# Altium project Main Board.PrjPcb
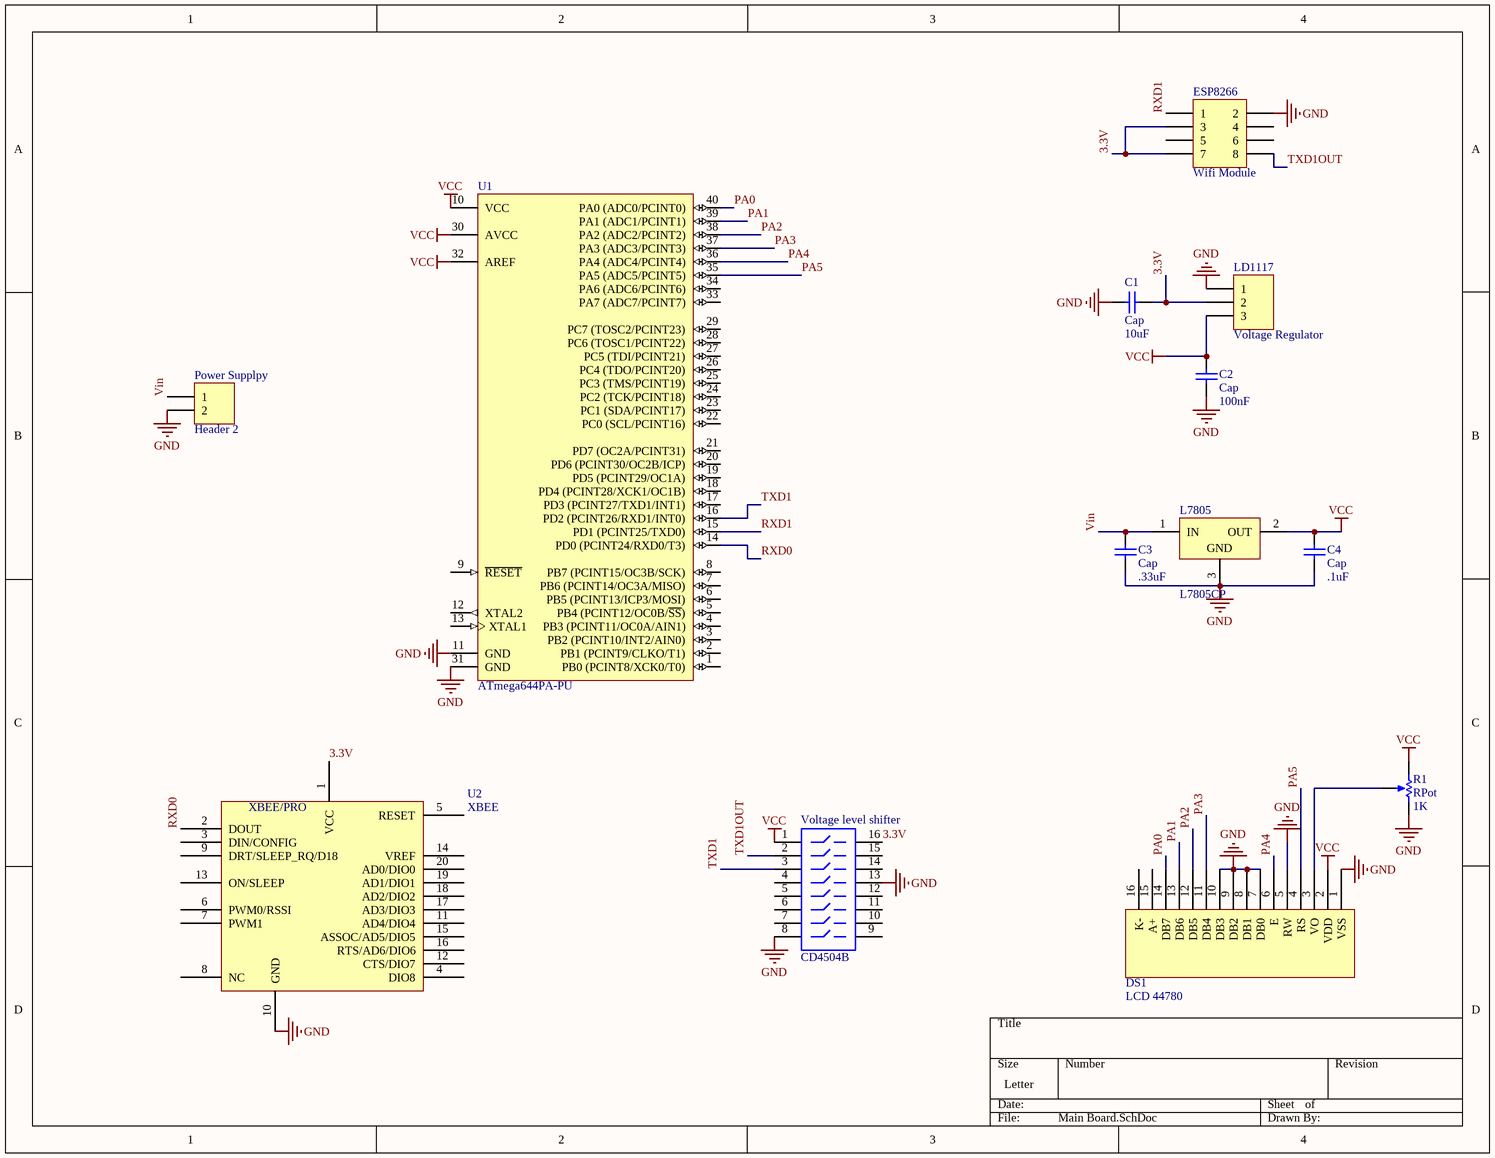
[diagram p0: Main Board.SchDoc]
1 sheet, 13 parts. Net scope: global (net labels, ports and power ports of the same name join across sheets).
Board file: Main Board.PcbDoc

## Sheet Main Board.SchDoc
size Letter

### Parts
C1  Cap  value 10uF  [RAD-0.3]
C2  Cap  value 100nF  [RAD-0.3]
C3  Cap  value .33uF  [RAD-0.3]
C4  Cap  value .1uF  [RAD-0.3]
DS1  LCD 44780  [OLED 16x2]
ESP8266  Wifi Module  [HDR2X4]
L7805  L7805CP  [ISOWATT220AB]
LD1117  Voltage Regulator  [HDR1X3]
Power_Supplpy  Header 2  [HDR1X2]
R1  RPot  value 1K  [VR5]
U1  ATmega644PA-PU  [40P6]
U2  XBEE  [XBEE/PRO]
Voltage_level_shifter  CD4504B  [DIP-16-KEY]

### Nets
GND: C1.1 C2.2 C3.1 C4.1 DS1.1(VSS) DS1.5(RW) DS1.7(DB0) DS1.8(DB1) DS1.9(DB2) DS1.10(DB3) ESP8266.2 L7805.3(GND) LD1117.1 Power_Supplpy.2 R1.2(BOT) U1.11(GND) U1.31(GND) U2.10(GND) Voltage_level_shifter.8 Voltage_level_shifter.13
VCC: C2.1 C4.2 DS1.2(VDD) L7805.2(OUT) LD1117.3 R1.1(TOP) U1.10(VCC) U1.30(AVCC) U1.32(AREF) Voltage_level_shifter.1
3.3V: C1.2 ESP8266.3 ESP8266.7 LD1117.2 U2.1(VCC) Voltage_level_shifter.16
PA0: DS1.14(DB7) U1.40(PA0_(ADC0/PCINT0))
PA1: DS1.13(DB6) U1.39(PA1_(ADC1/PCINT1))
PA2: DS1.12(DB5) U1.38(PA2_(ADC2/PCINT2))
PA3: DS1.11(DB4) U1.37(PA3_(ADC3/PCINT3))
PA4: DS1.6(E) U1.36(PA4_(ADC4/PCINT4))
PA5: DS1.4(RS) U1.35(PA5_(ADC5/PCINT5))
RXD0: U1.14(PD0_(PCINT24/RXD0/T3)) U2.2(DOUT)
RXD1: ESP8266.1 U1.15(PD1_(PCINT25/TXD0))
TXD1: U1.16(PD2_(PCINT26/RXD1/INT0)) Voltage_level_shifter.3
TXD1OUT: ESP8266.8 Voltage_level_shifter.2
Vin: C3.2 L7805.1(IN) Power_Supplpy.1
NetDS1_3: DS1.3(VO) R1.3(TAP)

Not connected (* = marked no-connect by the designer): DS1 15(A+) 16(K-); ESP8266 4 5 6; U1 1(PB0_(PCINT8/XCK0/T0)) 2(PB1_(PCINT9/CLKO/T1)) 3(PB2_(PCINT10/INT2/AIN0)) 4(PB3_(PCINT11/OC0A/AIN1)) 5(PB4_(PCINT12/OC0B/~{SS})) 6(PB5_(PCINT13/ICP3/MOSI)) 7(PB6_(PCINT14/OC3A/MISO)) 8(PB7_(PCINT15/OC3B/SCK)) 9(~{RESET}) 12(XTAL2) 13(XTAL1) 17(PD3_(PCINT27/TXD1/INT1)) 18(PD4_(PCINT28/XCK1/OC1B)) 19(PD5_(PCINT29/OC1A)) 20(PD6_(PCINT30/OC2B/ICP)) 21(PD7_(OC2A/PCINT31)) 22(PC0_(SCL/PCINT16)) 23(PC1_(SDA/PCINT17)) 24(PC2_(TCK/PCINT18)) 25(PC3_(TMS/PCINT19)) 26(PC4_(TDO/PCINT20)) 27(PC5_(TDI/PCINT21)) 28(PC6_(TOSC1/PCINT22)) 29(PC7_(TOSC2/PCINT23)) 33(PA7_(ADC7/PCINT7)) 34(PA6_(ADC6/PCINT6)); U2 3(DIN/CONFIG) 4(DIO8) 5(RESET) 6(PWM0/RSSI) 7(PWM1) 8(NC) 9(DRT/SLEEP_RQ/D18) 11(AD4/DIO4) 12(CTS/DIO7) 13(ON/SLEEP) 14(VREF) 15(ASSOC/AD5/DIO5) 16(RTS/AD6/DIO6) 17(AD3/DIO3) 18(AD2/DIO2) 19(AD1/DIO1) 20(AD0/DIO0); Voltage_level_shifter 4 5 6 7 9 10 11 12 14 15

### Notes on the sheet
- (in symbol XBEE) XBEE/PRO

### Library data of the parts
C1-C4 = Cap: Capacitor; Published: 8-Jun-2000; LatestRevisionDate: 17-Jul-2002; LatestRevisionNote: Re-released for DXP Platform.; PackageReference: RAD-0.3; Publisher: Altium Limited; PackageDescription: Radial Cap, Thru-Hole; 2 Leads; 0.3 in Pin Spacing
ESP8266 = Header 4X2: Header, 4-Pin, Dual row; LatestRevisionDate: 17-Jul-2002; LatestRevisionNote: Re-released for DXP Platform.; Publisher: Altium Limited
L7805 = L7805CP: Positive Voltage Regulator; Note: Tab is connected to pin 3 (GND).; Published: 24-Aug-2001; LatestRevisionDate: 17-Jul-2002; LatestRevisionNote: Re-released for DXP Platform.; DatasheetVersion: Dec-1998; PackageVersion: Jul-1998; PackageReference: ISOWATT220AB; Publisher: Altium Limited; PackageDescription: TO, Thru-Hole, Vertical, Heatsink Mounted; 3 In-Line Leads; Pitch 2.54 mm; Pin sequence 1, 3, 2; ComponentLink1Description: Manufacturer Link; ComponentLink1URL: http://www.st.com/
LD1117 = Header 3: Header, 3-Pin; LatestRevisionDate: 17-Jul-2002; LatestRevisionNote: Re-released for DXP Platform.; Publisher: Altium Limited
Power_Supplpy = Header 2: Header, 2-Pin; LatestRevisionDate: 17-Jul-2002; LatestRevisionNote: Re-released for DXP Platform.; Publisher: Altium Limited
R1 = RPot: Potentiometer; Sim Note: Enter the Resistance value and the set point into parameter fields.; Set Position: 0.5; Published: 8-Jun-2000; LatestRevisionDate: 17-Jul-2002; LatestRevisionNote: Re-released for DXP Platform.; PackageReference: VR5; Publisher: Altium Limited; PackageDescription: Variable Resistor, Thru-Hole; 3 Leads
U1 = ATmega644PA-PU: 8-bit AVR Microcontroller, 64KB Flash, 2KB EEPROM, 4KB SRAM, 40-pin PDIP, Industrial Grade (-40°C to 85°C); DatasheetVersion: revC, Jun-2011; PackageVersion: revB, Sep-2001; PackageReference: 40P6; PackageDescription: 40-lead (0.600"/15.24mm Wide) Plastic Dual Inline Package (PDIP); Code_JEDEC: MS-011-AC; ComponentLink1Description: Manufacturer URL; ComponentLink1URL: http://www.atmel.com/; ComponentLink2Description: ATmega164A/164PA/324A/324PA/644A/644PA/1284/1284P Datasheet; ComponentLink2URL: http://www.atmel.com/dyn/resources/prod_documents/doc8272.pdf; ComponentLink3Description: ATmega164A/164PA/324A/324PA/644A/644PA/1284/1284P Summary; ComponentLink3URL: http://www.atmel.com/dyn/resources/prod_documents/8272S.pdf
Voltage_level_shifter = SW-DIP8: 4009 Series DIP Switch, Raised actuator; Published: 24-Mar-1999; LatestRevisionDate: 17-Dec-2003; LatestRevisionNote: PCB Footprint replaced.; PackageReference: DIP-16-KEY; Publisher: Altium Limited; PackageDescription: DIP; 16 Leads; Row Spacing 7.62 mm; Pitch 2.54 mm; ComponentLink1Description: Manufacturer Link; ComponentLink1URL: http://www.oupiin.com/prodindx.html#Headers